# EAGLE schematic main_board (EAGLE 7.6.0)
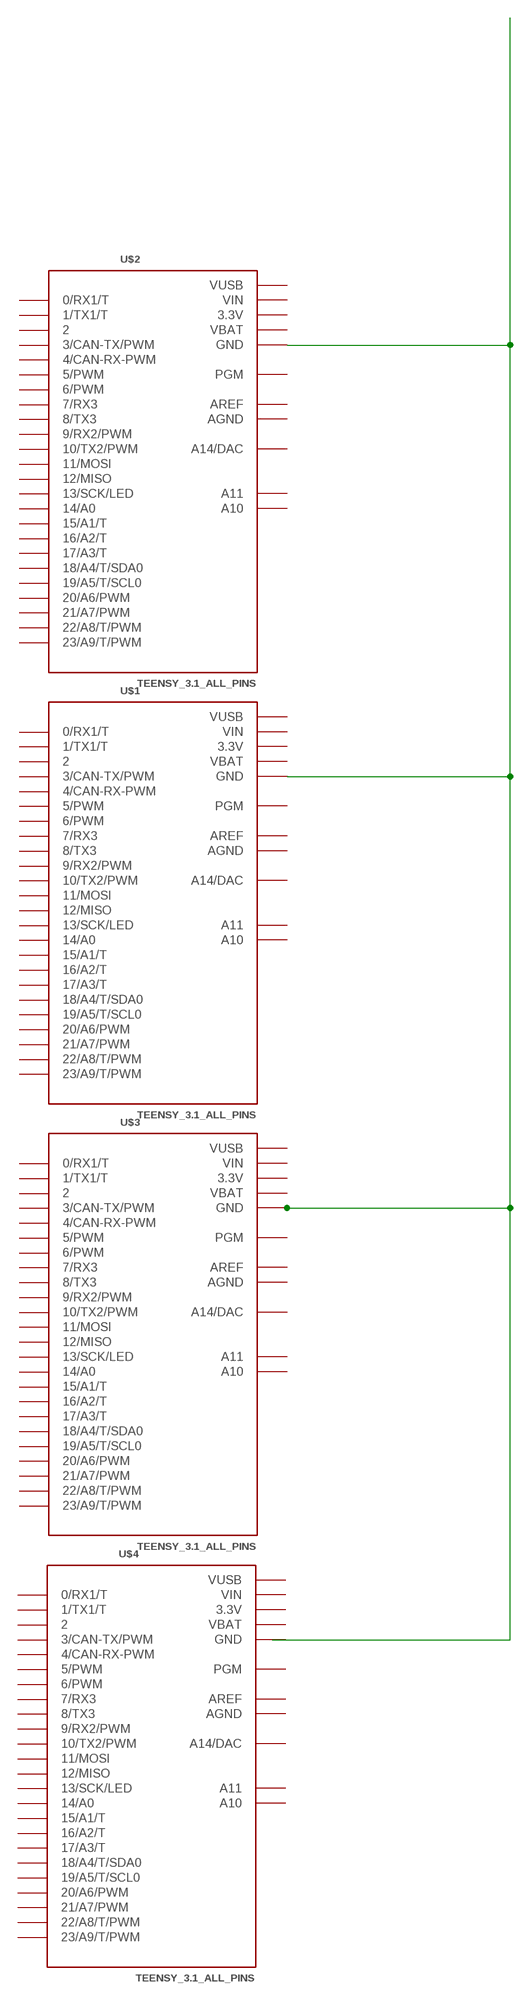
[diagram p0: schematic, sheet 1]

## Parts
U$1  TEENSY_3.1_ALL_PINS  [TEENSY3-ALL_PINS]
U$2  TEENSY_3.1_ALL_PINS  [TEENSY3-ALL_PINS]
U$3  TEENSY_3.1_ALL_PINS  [TEENSY3-ALL_PINS]
U$4  TEENSY_3.1_ALL_PINS  [TEENSY3-ALL_PINS]

## Nets
N$1: U$1.GND U$1.GND1(GND) U$2.GND U$2.GND1(GND) U$3.GND U$3.GND1(GND)
Unconnected: U$1.0(0/RX1/T) U$1.1(1/TX1/T) U$1.2 U$1.3(3/CAN-TX/PWM) U$1.4(4/CAN-RX-PWM) U$1.5(5/PWM) U$1.6(6/PWM) U$1.7(7/RX3) U$1.8(8/TX3) U$1.9(9/RX2/PWM) U$1.10(10/TX2/PWM) U$1.11(11/MOSI) U$1.12(12/MISO) U$1.13(13/SCK/LED) U$1.14/A0 U$1.15/A1(15/A1/T) U$1.16/A2(16/A2/T) U$1.17/A3(17/A3/T) U$1.18/A4(18/A4/T/SDA0) U$1.19/A5(19/A5/T/SCL0) U$1.20/A6(20/A6/PWM) U$1.21/A7(21/A7/PWM) U$1.22/A8(22/A8/T/PWM) U$1.23/A9(23/A9/T/PWM) U$1.A10 U$1.A11 U$1.PGM U$1.RESET/DAC(A14/DAC) U$2.0(0/RX1/T) U$2.1(1/TX1/T) U$2.2 U$2.3(3/CAN-TX/PWM) U$2.4(4/CAN-RX-PWM) U$2.5(5/PWM) U$2.6(6/PWM) U$2.7(7/RX3) U$2.8(8/TX3) U$2.9(9/RX2/PWM) U$2.10(10/TX2/PWM) U$2.11(11/MOSI) U$2.12(12/MISO) U$2.13(13/SCK/LED) U$2.14/A0 U$2.15/A1(15/A1/T) U$2.16/A2(16/A2/T) U$2.17/A3(17/A3/T) U$2.18/A4(18/A4/T/SDA0) U$2.19/A5(19/A5/T/SCL0) U$2.20/A6(20/A6/PWM) U$2.21/A7(21/A7/PWM) U$2.22/A8(22/A8/T/PWM) U$2.23/A9(23/A9/T/PWM) U$2.A10 U$2.A11 U$2.PGM U$2.RESET/DAC(A14/DAC) U$3.0(0/RX1/T) U$3.1(1/TX1/T) U$3.2 U$3.3(3/CAN-TX/PWM) U$3.4(4/CAN-RX-PWM) U$3.5(5/PWM) U$3.6(6/PWM) U$3.7(7/RX3) U$3.8(8/TX3) U$3.9(9/RX2/PWM) U$3.10(10/TX2/PWM) U$3.11(11/MOSI) U$3.12(12/MISO) U$3.13(13/SCK/LED) U$3.14/A0 U$3.15/A1(15/A1/T) U$3.16/A2(16/A2/T) U$3.17/A3(17/A3/T) U$3.18/A4(18/A4/T/SDA0) U$3.19/A5(19/A5/T/SCL0) U$3.20/A6(20/A6/PWM) U$3.21/A7(21/A7/PWM) U$3.22/A8(22/A8/T/PWM) U$3.23/A9(23/A9/T/PWM) U$3.A10 U$3.A11 U$3.PGM U$3.RESET/DAC(A14/DAC) U$4.0(0/RX1/T) U$4.1(1/TX1/T) U$4.2 U$4.3(3/CAN-TX/PWM) U$4.4(4/CAN-RX-PWM) U$4.5(5/PWM) U$4.6(6/PWM) U$4.7(7/RX3) U$4.8(8/TX3) U$4.9(9/RX2/PWM) U$4.10(10/TX2/PWM) U$4.11(11/MOSI) U$4.12(12/MISO) U$4.13(13/SCK/LED) U$4.14/A0 U$4.15/A1(15/A1/T) U$4.16/A2(16/A2/T) U$4.17/A3(17/A3/T) U$4.18/A4(18/A4/T/SDA0) U$4.19/A5(19/A5/T/SCL0) U$4.20/A6(20/A6/PWM) U$4.21/A7(21/A7/PWM) U$4.22/A8(22/A8/T/PWM) U$4.23/A9(23/A9/T/PWM) U$4.A10 U$4.A11 U$4.PGM U$4.RESET/DAC(A14/DAC)

## Power pins joined to a net without a drawn wire
3.3V: U$1.3.3V U$1.3.3V1(3.3V) U$2.3.3V U$2.3.3V1(3.3V) U$3.3.3V U$3.3.3V1(3.3V) U$4.3.3V U$4.3.3V1(3.3V)
AGND: U$1.AGND U$2.AGND U$3.AGND U$4.AGND
AREF: U$1.AREF U$2.AREF U$3.AREF U$4.AREF
GND: U$4.GND U$4.GND1(GND)
VBAT: U$1.VBAT U$2.VBAT U$3.VBAT U$4.VBAT
VIN: U$1.VIN U$2.VIN U$3.VIN U$4.VIN
VUSB: U$1.VUSB U$2.VUSB U$3.VUSB U$4.VUSB

## Library data of the parts
U$1-U$4 = Teensy_3_and_LC_Series_Boards_v1.1:TEENSY_3.1_ALL_PINS: Footprint for Teensy 3.1 or 3.2 board using all through-holes, i.e. the entire perimeter plus the 4 through-holes inboard (A10,A11,AREF, VUSB)